# Altium schematic sheet STM32.SchDoc
size A4
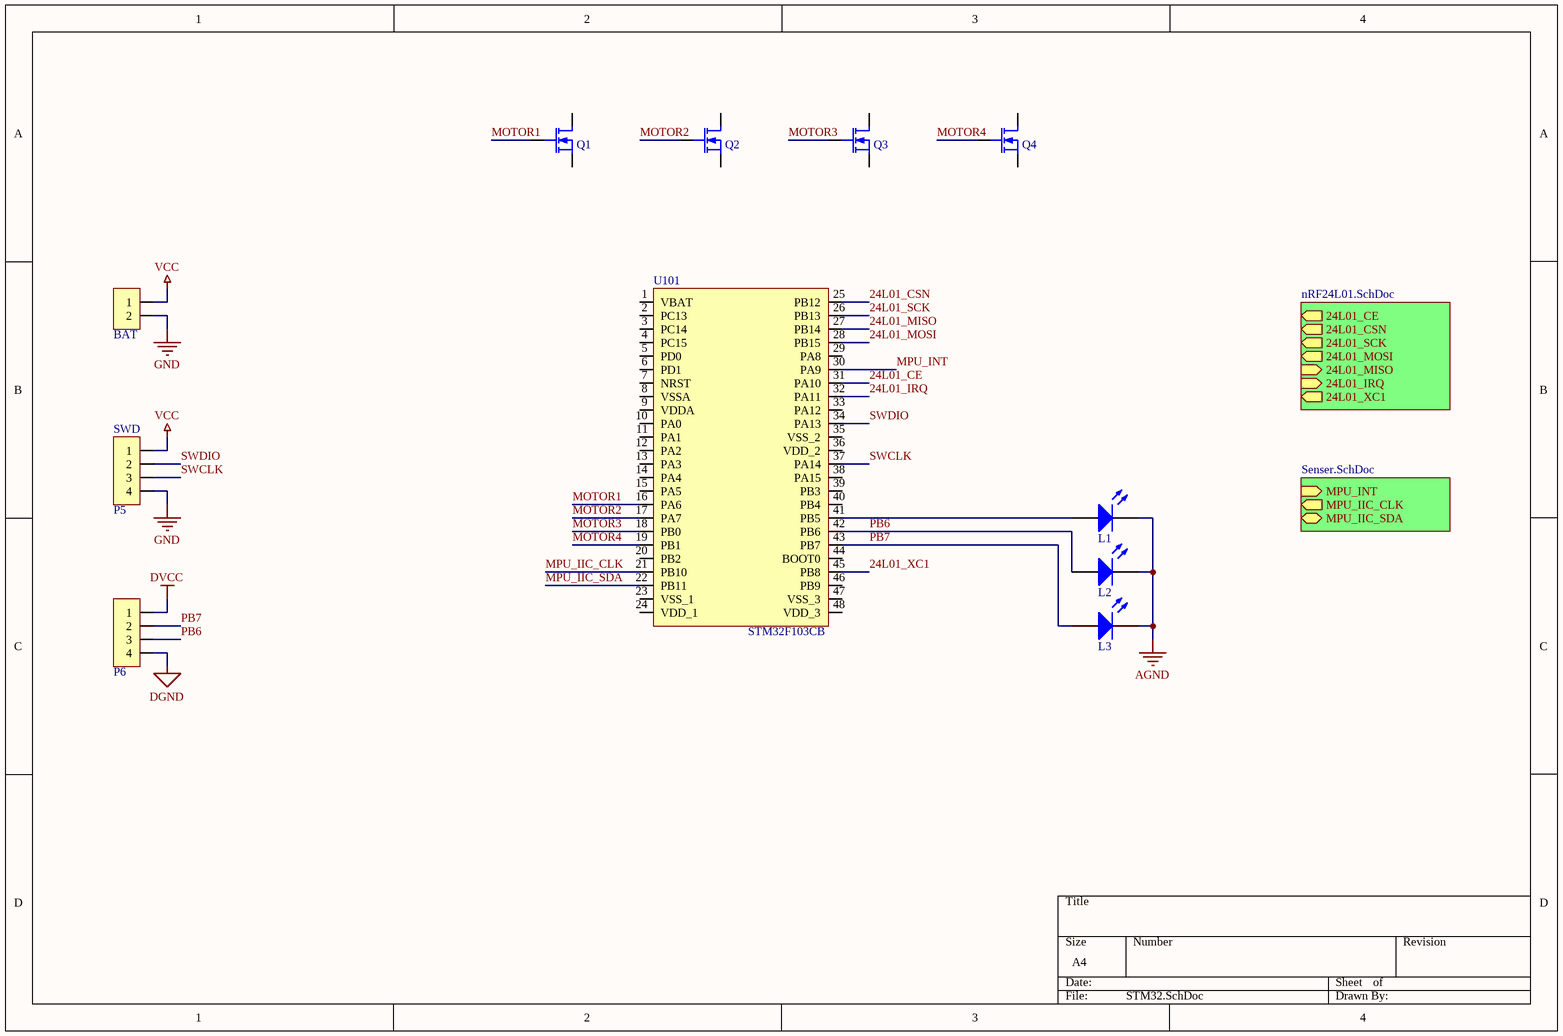
[diagram p0: STM32.SchDoc]

## Parts
BAT  Port2  (value not drawn)
L1  LED  (value not drawn)
L2  LED  (value not drawn)
L3  LED  (value not drawn)
P5  SWD
P6  Port4  (value not drawn)
Q1  PWV31XN  (value not drawn)
Q2  PWV31XN  (value not drawn)
Q3  PWV31XN  (value not drawn)
Q4  PWV31XN  (value not drawn)
U101  STM32F103CB

## Sub-sheets
nRF24L01 = nRF24L01.SchDoc: 24L01_CE (out), 24L01_CSN (out), 24L01_SCK (out), 24L01_MOSI (out), 24L01_MISO (in), 24L01_IRQ (in), 24L01_XC1 (out)
Senser = Senser.SchDoc: MPU_INT (in), MPU_IIC_CLK (out), MPU_IIC_SDA (bidir)

## Nets
AGND: L1.2(K) L2.2(K) L3.2(K)
DGND: P6.4
DVCC: P6.1
GND: BAT.2 P5.4
VCC: BAT.1 P5.1
24L01_CE: U101.31(PA10)
24L01_CSN: U101.25(PB12)
24L01_IRQ: U101.32(PA11)
24L01_MISO: U101.27(PB14)
24L01_MOSI: U101.28(PB15)
24L01_SCK: U101.26(PB13)
24L01_XC1: U101.45(PB8)
MOTOR1: Q1.2(G) U101.16(PA6)
MOTOR2: Q2.2(G) U101.17(PA7)
MOTOR3: Q3.2(G) U101.18(PB0)
MOTOR4: Q4.2(G) U101.19(PB1)
MPU_IIC_CLK: U101.21(PB10)
MPU_IIC_SDA: U101.22(PB11)
MPU_INT: U101.30(PA9)
PB6: L2.1(A) P6.3 U101.42(PB6)
PB7: L3.1(A) P6.2 U101.43(PB7)
SWCLK: P5.3 U101.37(PA14)
SWDIO: P5.2 U101.34(PA13)
NetL1_1: L1.1(A) U101.41(PB5)

Not connected (* = marked no-connect by the designer): Q1 1(D) 3(S); Q2 1(D) 3(S); Q3 1(D) 3(S); Q4 1(D) 3(S); U101 1(VBAT) 2(PC13) 3(PC14) 4(PC15) 5(PD0) 6(PD1) 7(NRST) 8(VSSA) 9(VDDA) 10(PA0) 11(PA1) 12(PA2) 13(PA3) 14(PA4) 15(PA5) 20(PB2) 23(VSS_1) 24(VDD_1) 29(PA8) 33(PA12) 35(VSS_2) 36(VDD_2) 38(PA15) 39(PB3) 40(PB4) 44(BOOT0) 46(PB9) 47(VSS_3) 48(VDD_3)

## Library data of the parts
BAT = Port2: PowerSupply
P5 = Port4
U101 = STM32F103C8\CB